# EAGLE design SyNetLEDv2 (EAGLE 6.1)
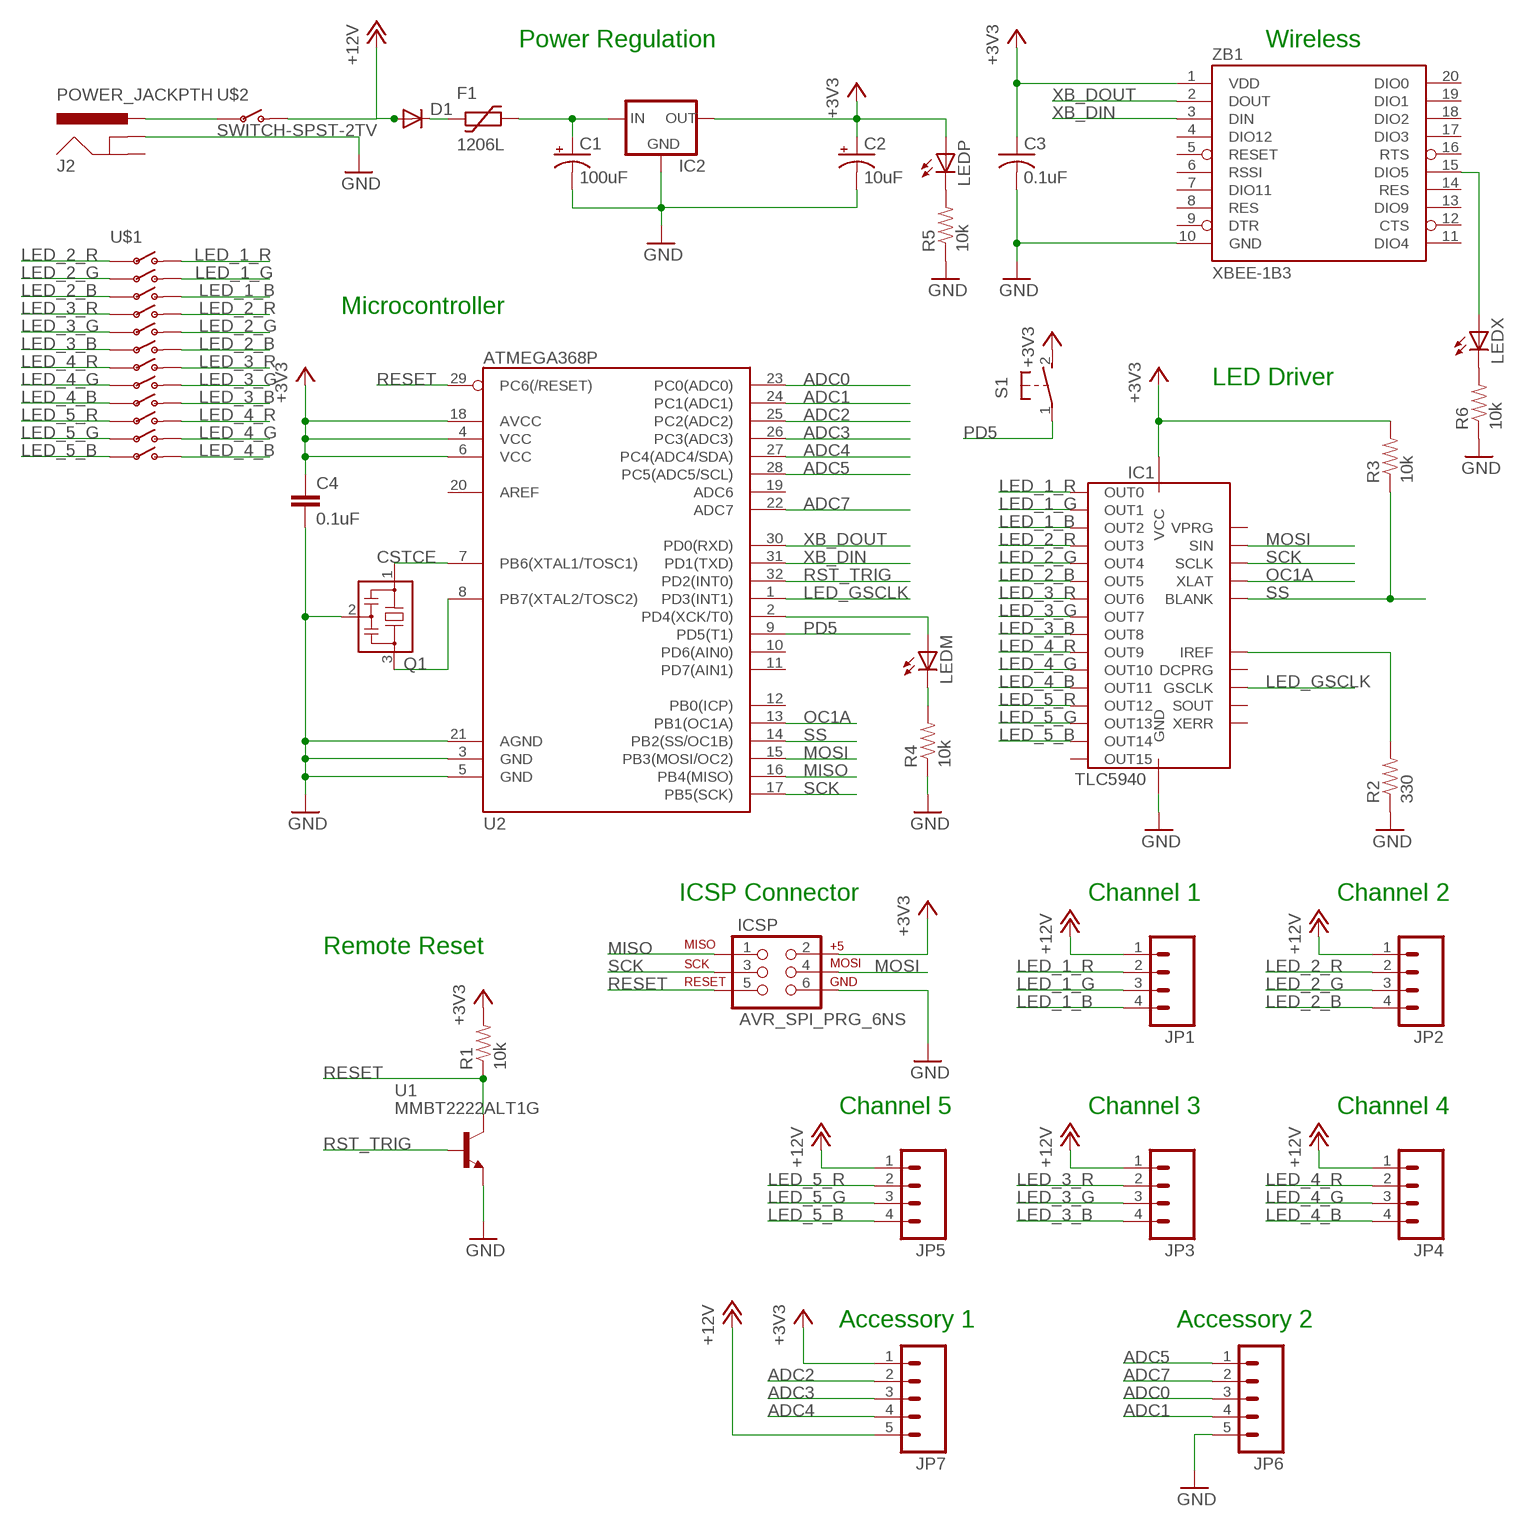
[diagram p0: schematic, sheet 1]

## Parts
C1  100uF  CPOL-USUD-8X10  [UD-8X10_NICHICON]
C2  10uF  CPOL-USUD-4X5,8  [UD-4X5,8_NICHICON]
C3  0.1uF  C-USC1608  [C1608]
C4  0.1uF  CAP0603-CAP  [0603-CAP]
D1  DIODESOD  [SOD-323]
F1  1206L  [1206L]
IC1  TLC5940  IC-PACKAGE_DIL28IC_PACKAGE_HTSSOP28PWP  [HTSSOP28PWP]
IC2  78LXXSMD  [SOT223]
ICSP  AVR_SPI_PRG_6NS  [2X3-NS]
J2  POWER_JACKPTH  [POWER_JACK_PTH]
JP1  M04POLAR  [MOLEX-1X4]
JP2  M04POLAR  [MOLEX-1X4]
JP3  M04POLAR  [MOLEX-1X4]
JP4  M04POLAR  [MOLEX-1X4]
JP5  M04POLAR  [MOLEX-1X4]
JP6  M05PTH  [1X05]
JP7  M05PTH  [1X05]
LEDM  LEDSMT-RT  [LED-SMT-RT]
LEDP  LEDSMT-RT  [LED-SMT-RT]
LEDX  LEDSMT-RT  [LED-SMT-RT]
Q1  CSTCE  [CSTCE8]
R1  10k  RESISTOR0603-RES  [0603-RES]
R2  330  RESISTOR0603-RES  [0603-RES]
R3  10k  RESISTOR0603-RES  [0603-RES]
R4  10k  RESISTOR0603-RES  [0603-RES]
R5  10k  RESISTOR0603-RES  [0603-RES]
R6  10k  RESISTOR0603-RES  [0603-RES]
S1  31-XX  [B3F-31XX]
U1  MMBT2222ALT1G  [SOT23]
U2  ATMEGA368P  [TQFP32-08]
U$1  DIP12DIP12TH  [DIP12TH]
U$2  SWITCH-SPST-2TV  [SWITCH-SPST-VERTICAL]
ZB1  XBEE-1B3  [XBEE-SMD]

## Nets
+3V3: C2.+ C3.1 C4.1 IC1.28(VCC) IC2.3(OUT) ICSP.2 JP7.1 LEDP.P$1A(A) R1.2 R3.2 S1.2(S) U2.4(VCC) U2.6(VCC) U2.18(AVCC) ZB1.1(VDD)
+12V: D1.2(A) JP1.1 JP2.1 JP3.1 JP4.1 JP5.1 JP7.5 U$2.1(O)
ADC0: JP6.3 U2.23(PC0(ADC0))
ADC1: JP6.4 U2.24(PC1(ADC1))
ADC2: JP7.2 U2.25(PC2(ADC2))
ADC3: JP7.3 U2.26(PC3(ADC3))
ADC4: JP7.4 U2.27(PC4(ADC4/SDA))
ADC5: JP6.1 U2.28(PC5(ADC5/SCL))
ADC7: JP6.2 U2.22(ADC7)
GND: C1.- C2.- C3.2 C4.2 IC1.1(GND) IC2.2(GND) IC2.4(GND) ICSP.6 J2.GNDBREAK JP6.5 Q1.2 R2.1 R4.1 R5.1 R6.1 U1.2(E) U2.3(GND) U2.5(GND) U2.21(AGND) ZB1.10(GND)
LED_1_B: IC1.9(OUT2) JP1.4 U$1.P$3(P3B)
LED_1_G: IC1.8(OUT1) JP1.3 U$1.P$2(P2B)
LED_1_R: IC1.7(OUT0) JP1.2 U$1.P$1(P1B)
LED_2_B: IC1.12(OUT5) JP2.4 U$1.O$3(P3A) U$1.P$6(P6B)
LED_2_G: IC1.11(OUT4) JP2.3 U$1.O$2(P2A) U$1.P$5(P5B)
LED_2_R: IC1.10(OUT3) JP2.2 U$1.O$1(P1A) U$1.P$4(P4B)
LED_3_B: IC1.15(OUT8) JP3.4 U$1.O$6(P6A) U$1.P$9(P9B)
LED_3_G: IC1.14(OUT7) JP3.3 U$1.O$5(P5A) U$1.P$8(P8B)
LED_3_R: IC1.13(OUT6) JP3.2 U$1.O$4(P4A) U$1.P$7(P7B)
LED_4_B: IC1.18(OUT11) JP4.4 U$1.O$9(P9A) U$1.P$12(P12B)
LED_4_G: IC1.17(OUT10) JP4.3 U$1.O$8(P8A) U$1.P$11(P11B)
LED_4_R: IC1.16(OUT9) JP4.2 U$1.O$7(P7A) U$1.P$10(P10B)
LED_5_B: IC1.21(OUT14) JP5.4 U$1.O$12(P12A)
LED_5_G: IC1.20(OUT13) JP5.3 U$1.O$11(P11A)
LED_5_R: IC1.19(OUT12) JP5.2 U$1.O$10(P10A)
LED_GSCLK: IC1.25(GSCLK) U2.1(PD3(INT1))
MISO: ICSP.1 U2.16(PB4(MISO))
MOSI: IC1.5(SIN) ICSP.4 U2.15(PB3(MOSI/OC2))
N$1: Q1.1 U2.7(PB6(XTAL1/TOSC1))
N$2: Q1.3 U2.8(PB7(XTAL2/TOSC2))
N$3: LEDM.P$1A(A) U2.2(PD4(XCK/T0))
N$4: D1.1(C) F1.P$1
N$5: C1.+ F1.P$2 IC2.1(IN)
N$6: IC1.27(IREF) R2.2
N$7: LEDM.P$2C(C) R4.2
N$8: LEDX.P$2C(C) R6.2
N$9: LEDP.P$2C(C) R5.2
N$10: LEDX.P$1A(A) ZB1.15(DIO5)
N$17: J2.PWR U$2.2(P)
OC1A: IC1.3(XLAT) U2.13(PB1(OC1A))
PD5: S1.1(P) U2.9(PD5(T1))
RESET: ICSP.5 R1.1 U1.3(C) U2.29(PC6(/RESET))
RST_TRIG: U1.1(B) U2.32(PD2(INT0))
SCK: IC1.4(SCLK) ICSP.3 U2.17(PB5(SCK))
SS: IC1.2(BLANK) R3.1 U2.14(PB2(SS/OC1B))
XB_DIN: U2.31(PD1(TXD)) ZB1.3(DIN)
XB_DOUT: U2.30(PD0(RXD)) ZB1.2(DOUT)
Unconnected: IC1.6(VPRG) IC1.22(OUT15) IC1.23(XERR) IC1.24(SOUT) IC1.26(DCPRG) J2.GND U2.10(PD6(AIN0)) U2.11(PD7(AIN1)) U2.12(PB0(ICP)) U2.19(ADC6) U2.20(AREF) ZB1.4(DIO12) ZB1.5(RESET) ZB1.6(RSSI) ZB1.7(DIO11) ZB1.8(RES) ZB1.9(DTR) ZB1.11(DIO4) ZB1.12(CTS) ZB1.13(DIO9) ZB1.14(RES) ZB1.16(RTS) ZB1.17(DIO3) ZB1.18(DIO2) ZB1.19(DIO1) ZB1.20(DIO0)

## Notes on the sheet
- Power Regulation | Wireless
- Microcontroller
- LED Driver
- ICSP Connector | Channel 1 | Channel 2
- Remote Reset
- Channel 5 | Channel 3 | Channel 4
- Accessory 1 | Accessory 2

## Library data of the parts
C1 C2 = rcl:CPOL-US: POLARIZED CAPACITOR, American symbol
C3 = rcl:C-US: CAPACITOR, American symbol
C4 = SparkFun-Passives:CAP: Capacitor Standard 0603 ceramic capacitor, and 0.1" leaded capacitor.
D1 = SparkFun-DiscreteSemi:DIODE: Diode These are standard reverse protection diodes and small signal diodes. SMA package can handle up to about 1A. SOD-323 can handle about 200mA. What the SOD-323 package when ordering, there are some mfgs out there that are 5-pin packages.
F1 = ptc-littlefuse:1206L
IC1 = TLC5940:IC-PACKAGE_DIL28: Dual In Line
IC2 = MikeCustom:78LXX: VOLTAGE REGULATOR
ICSP = SparkFun-Connectors:AVR_SPI_PRG_6: AVR ISP 6 Pin This is the reduced ISP connector for AVR programming. Common on Arduino. This footprint will take up less PCB space and can be used with a 10-pin to 6-pin adapter such as SKU: BOB-08508
J2 = SparkFun-Connectors:POWER_JACK: Power Jack This is the standard 5.5mm barrel jack for power. The PTH is the most common, proven, reliable, footprint. All others are experimental. The Slot footprint only works if the mill layer is transmitted to the PCB fab house so be warned. Spark Fun Electronics SKU : PRT-00119. Mating wall wart : TOL-00298 (and others)
JP1-JP5 = SparkFun-Connectors:M04: Header 4 Standard 4-pin 0.1" header. Use with straight break away headers (SKU : PRT-00116), right angle break away headers (PRT-00553), swiss pins (PRT-00743), machine pins (PRT-00117), and female headers (PRT-00115). Molex polarized connector foot print use with SKU : PRT-08231 with associated crimp pins and housings. 1MM SMD Version SKU: PRT-10208
JP6 JP7 = SparkFun-Connectors:M05: Header 5 Standard 5-pin 0.1" header. Use with straight break away headers (SKU : PRT-00116), right angle break away headers (PRT-00553), swiss pins (PRT-00743), machine pins (PRT-00117), and female headers (PRT-00115). Molex polarized connector foot print use with SKU : PRT-08230 with associated crimp pins and housings.
LEDM LEDP LEDX = SparkFun-LED:LED: LEDs Standard schematic elements and footprints for 5mm, 3mm, 1206, and 0603 sized LEDs. 5mm - Spark Fun Electronics SKU : COM-00529 (and others)
Q1 = murata-filter:CSTCE: Resonator Source: murata.co.jp
R1-R6 = SparkFun-Passives:RESISTOR: Resistor Basic schematic elements and footprints for 0603, 1206, and PTH resistors.
S1 = switch-omron:31-XX: OMRON SWITCH; MPN: B3F-3100; OC_FARNELL: 959704; OC_NEWARK: 36M3582
U1 = MikeCustom:MMBT2222ALT1G: NPN Transistor MMBT2222ALT1G from ON Semi
U2 = SparkFun-DigitalIC:ATMEGA368P: Atmega328P
U$1 = MikeCustom:DIP12
U$2 = MikeCustom:SWITCH-SPST-2
ZB1 = SparkFun-RF:XBEE-1: Xbee module footprints

## Board
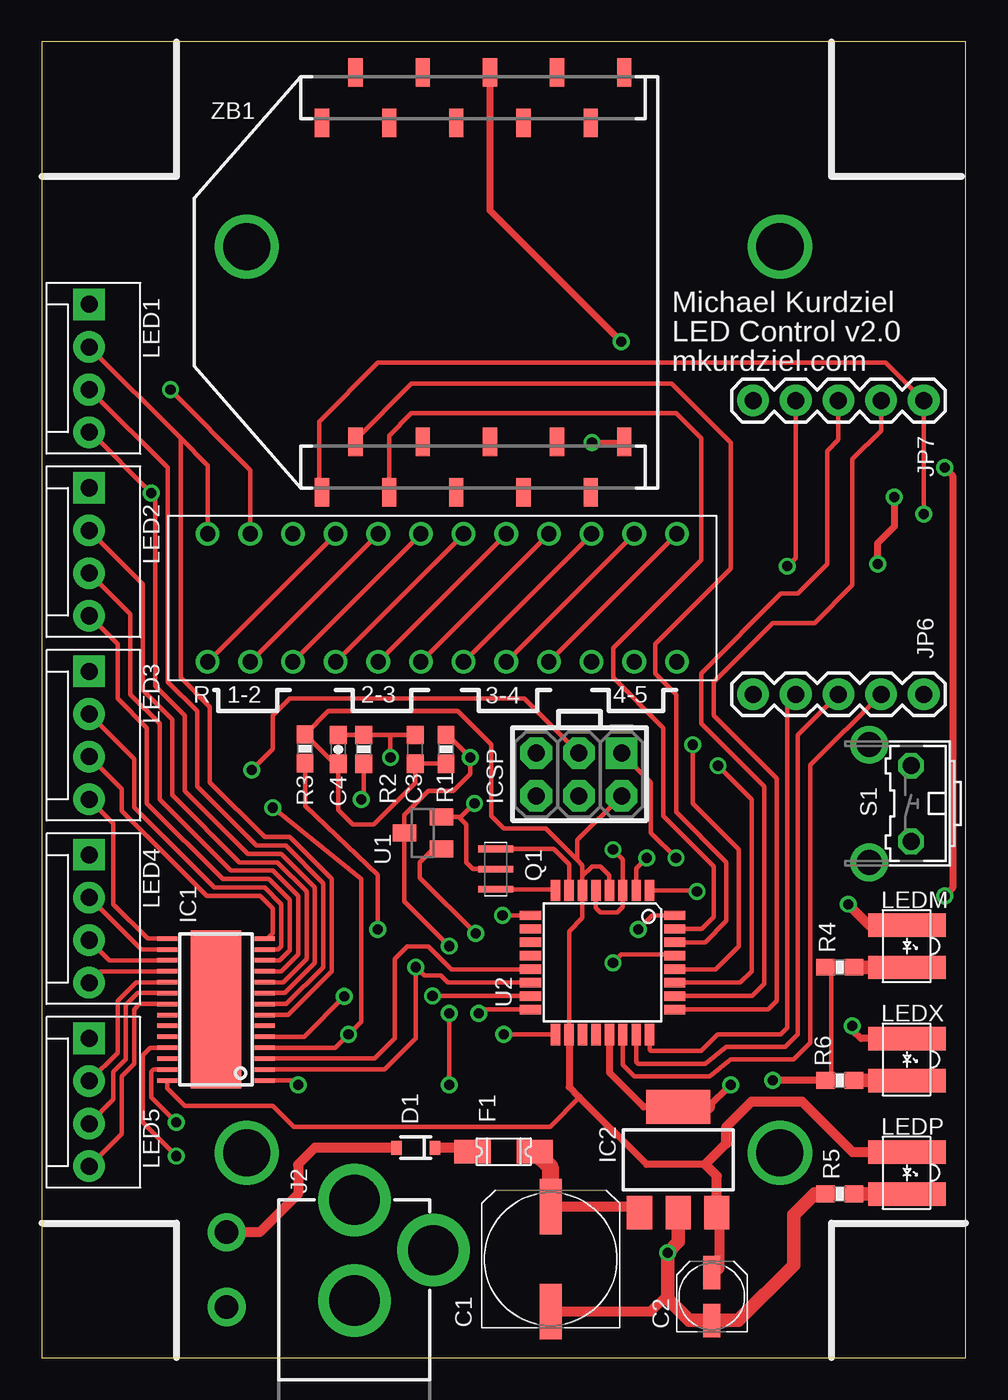
[diagram p1: board, top side]
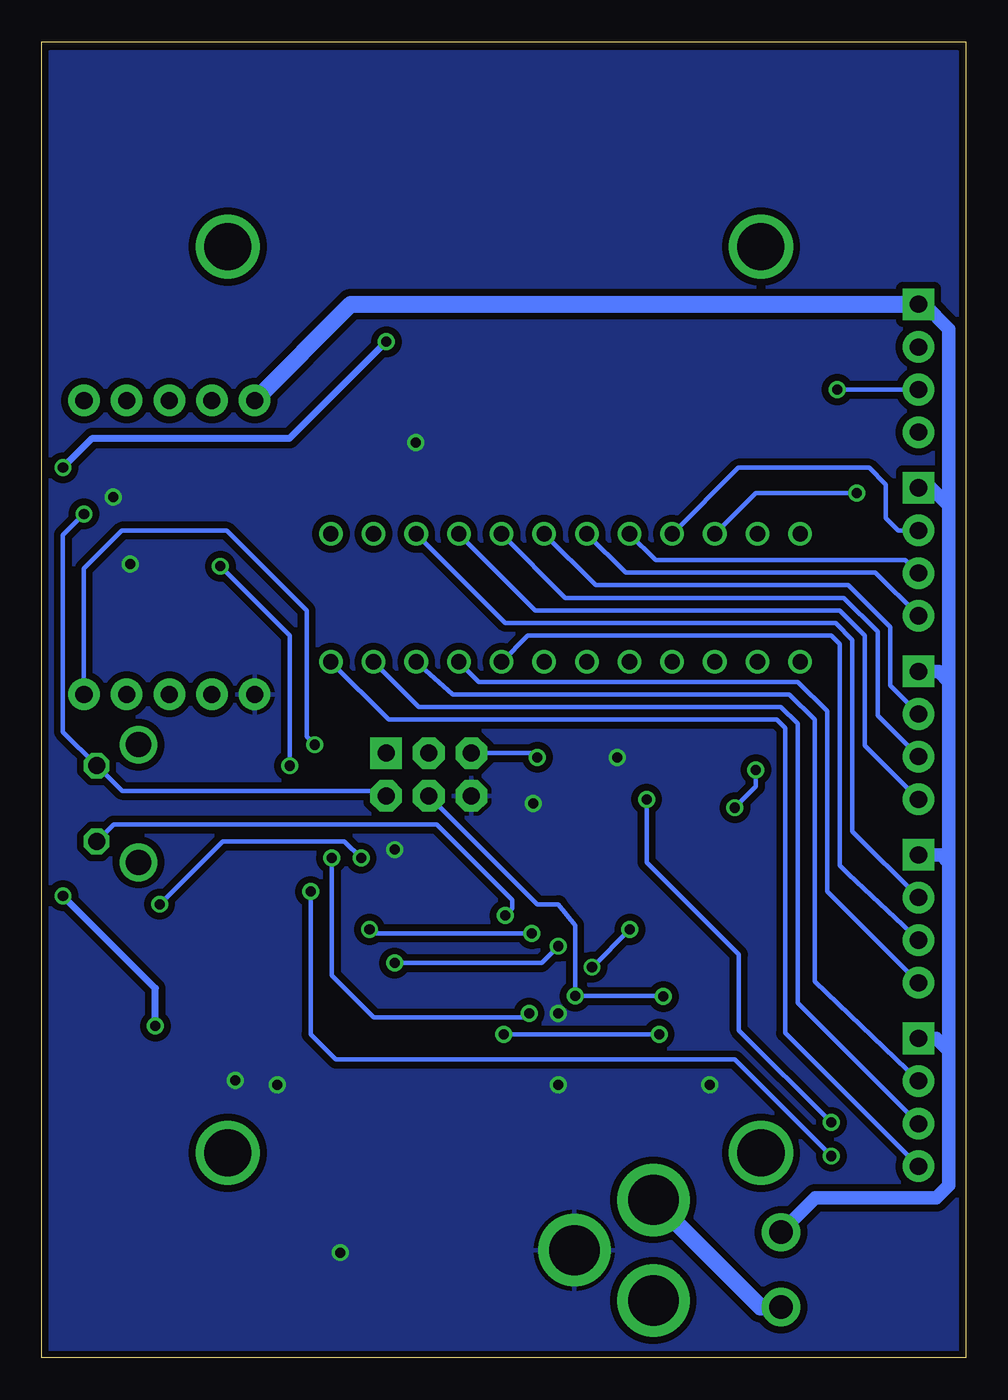
[diagram p2: board, bottom side, seen from below]

Size 55 x 78.36 mm. Coordinates in mm from the lower left corner, seen from the top.
Outline: 0,0 55,0 55,78.36 0,78.36 0,0
Copper layers (1*16): Top 0.035559375mm / dielectric 1.501140625mm / Bottom 0.035559375mm
Design rules: minimum track width 10mil, minimum drill 15mil, track to track 6mil, track to pad 6mil, pad to pad 6mil, via to via 6mil, smd to smd 6mil, copper to edge 15mil, drill to drill 8mil, minimum pad ring 10mil, minimum via ring 8mil, stop-mask expansion 4mil, vias tented up to drill 0mil, thermal gap 10mil

### Footprints (pad centres in the part's own frame; a part is rotated, then mirrored left to right if it is on the bottom)
UD-8X10_NICHICON = smd 3.3 x 1.3: + 3.125,0; - -3.125,0
UD-4X5,8_NICHICON = smd 2 x 1: + 1.425,0; - -1.425,0
C1608 = smd 1.1 x 1: 1 -0.85,0; 2 0.85,0
0603-CAP = smd 1.1 x 1: 1 -0.85,0; 2 0.85,0
SOD-323 = smd 0.63 x 0.83: 1 -1.15,0; 2 1.15,0
1206L = smd 2.16 x 1.4: P$1 -1.85,0; P$2 1.85,0
HTSSOP28PWP = smd 0.27 x 1.2: 1 -4.225,-2.9; 2 -3.575,-2.9; 3 -2.925,-2.9; 4 -2.275,-2.9; 5 -1.625,-2.9; 6 -0.975,-2.9; 7 -0.325,-2.9; 8 0.325,-2.9; 9 0.975,-2.9; 10 1.625,-2.9; 11 2.275,-2.9; 12 2.925,-2.9; 13 3.575,-2.9; 14 4.225,-2.9; 15 4.225,2.9; 16 3.575,2.9; 17 2.925,2.9; 18 2.275,2.9; 19 1.625,2.9; 20 0.975,2.9; 21 0.325,2.9; 22 -0.325,2.9; 23 -0.975,2.9; 24 -1.625,2.9; 25 -2.275,2.9; 26 -2.925,2.9; 27 -3.575,2.9; 28 -4.225,2.9 | smd 9.4 x 3: EXP 0,0
SOT223 = smd 1.5 x 2: 1 -2.3,-3.15; 2 0,-3.15; 3 2.3,-3.15 | smd 3.8 x 2: 4 0,3.15
2X3-NS = drill 1.016 pad 1.88 square: 1 -2.54,-1.27 | drill 1.016 pad 1.88 octagon: 2 -2.54,1.27; 3 0,-1.27; 4 0,1.27; 5 2.54,-1.27; 6 2.54,1.27
POWER_JACK_PTH = drill 2.997 pad 4.318: GND 0,7.7; GNDBREAK 4.7,10.7; PWR 0,13.7
MOLEX-1X4 = drill 1.016 pad 1.88 square: 1 0,0 | drill 1.016 pad 1.88: 2 2.54,0; 3 5.08,0; 4 7.62,0
1X05 = drill 1.016 pad 1.88: 1 0,0; 2 2.54,0; 3 5.08,0; 4 7.62,0; 5 10.16,0
LED-SMT-RT = smd 1.397 x 4.597: P$1A 0,0; P$2C 2.515,0
CSTCE8 = smd 0.4 x 2.1: 1 -1.8,0.3; 2 -0.6,0.3; 3 0.6,0.3
0603-RES = smd 1.1 x 1: 1 -0.85,0; 2 0.85,0
B3F-31XX = drill 1.016 octagon: 1 -2.261,-1.245; 2 2.261,-1.245 | drill 1.499 pad 2.159: 3 -3.505,1.245; 4 3.505,1.245
SOT23 = smd 1 x 1.4: 1 -0.95,-1.1; 2 0.95,-1.1; 3 0,1.1
TQFP32-08 = smd 1.27 x 0.559: 1 -4.293,2.8; 2 -4.293,2; 3 -4.293,1.2; 4 -4.293,0.4; 5 -4.293,-0.4; 6 -4.293,-1.2; 7 -4.293,-2; 8 -4.293,-2.8; 17 4.293,-2.8; 18 4.293,-2; 19 4.293,-1.2; 20 4.293,-0.4; 21 4.293,0.4; 22 4.293,1.2; 23 4.293,2; 24 4.293,2.8 | smd 0.559 x 1.27: 9 -2.8,-4.293; 10 -2,-4.293; 11 -1.2,-4.293; 12 -0.4,-4.293; 13 0.4,-4.293; 14 1.2,-4.293; 15 2,-4.293; 16 2.8,-4.293; 25 2.8,4.293; 26 2,4.293; 27 1.2,4.293; 28 0.4,4.293; 29 -0.4,4.293; 30 -1.2,4.293; 31 -2,4.293; 32 -2.8,4.293
DIP12TH = drill 0.9: O$1 2.36,-3.81; O$2 4.9,-3.81; O$3 7.44,-3.81; O$4 9.98,-3.81; O$5 12.52,-3.81; O$6 15.06,-3.81; O$7 17.6,-3.81; O$8 20.14,-3.81; O$9 22.68,-3.81; O$10 25.22,-3.81; O$11 27.76,-3.81; O$12 30.3,-3.81; P$1 2.36,3.81; P$2 4.9,3.81; P$3 7.44,3.81; P$4 9.98,3.81; P$5 12.52,3.81; P$6 15.06,3.81; P$7 17.6,3.81; P$8 20.14,3.81; P$9 22.68,3.81; P$10 25.22,3.81; P$11 27.76,3.81; P$12 30.3,3.81
SWITCH-SPST-VERTICAL = drill 1.4 pad 2.286: 1 0,4.46; 2 0,0
XBEE-SMD = smd 1.7 x 0.85: 1 -12.5,20; 2 -9.5,18; 3 -12.5,16; 4 -9.5,14; 5 -12.5,12; 6 -9.5,10; 7 -12.5,8; 8 -9.5,6; 9 -12.5,4; 10 -9.5,2; 11 12.5,2; 12 9.5,4; 13 12.5,6; 14 9.5,8; 15 12.5,10; 16 9.5,12; 17 12.5,14; 18 9.5,16; 19 12.5,18; 20 9.5,20

### Placement (x,y rotation side)
C1  30.29,5.87 90 top
C2  39.88,3.64 90 top
C3  22.22,36.23 90 top
C4  17.64,36.23 90 top
D1  22.25,12.5 180 top
F1  27.49,12.26 0 top
IC1  10.36,20.73 90 top
IC2  37.88,11.78 0 top
ICSP  31.97,34.73 180 top
J2  18.6,-4.31 0 top
JP1  2.81,62.73 270 top
JP2  2.81,51.8 270 top
JP3  2.81,40.87 270 top
JP4  2.81,29.94 270 top
JP5  2.81,19.01 270 top
JP6  52.5,39.5 180 top
JP7  52.5,57 180 top
LEDM  51.5,25.75 270 top
LEDP  51.5,12.25 270 top
LEDX  51.5,19 270 top
Q1  26.72,28.49 270 top
R1  24.05,36.23 270 top
R2  19.15,36.23 270 top
R3  15.66,36.26 90 top
R4  47.5,23.25 0 top
R5  47.5,9.75 0 top
R6  47.5,16.5 0 top
S1  50.5,33 90 top
U1  22.68,31.25 90 top
U2  33.38,23.53 270 top
U$1  7.5,45.25 0 top
U$2  11,3 0 top
ZB1  36.67,64.04 90 top

### Tracks (layer width: path | path; a pad name or v marks a point on that pad's centre or on a via)
+3V3  (via drill 0.6)
  Top 0.254: R1.2 C3.1 22.22,34.22 19.75,31.75 18.5,31.75 17.64,32.61 C4.1 17.39,35.38 R3.2 17.05,38.5 24.75,38.5 26.75,36.5 26.75,32.25 27.5,31.5 30,31.5 31.88,29.62 | U2.18 31.38,25.38 32.18,26.18 U2.6 32.18,28.68 | U2.4 33.78,28.72 33.25,29.25 32.75,29.25 32.18,28.68 | 40.31,8.44 40.31,7.75 | IC1.28 7.46,16.04 8.5,15 13.75,15 15,13.75 30.25,13.75 32,15.5 | ZB1.1 16.67,51.83 16.5,52 16.5,55.75 20,59.25 50.25,59.25 JP7.1 v52.5,50.25 | 32.18,28.68 32.18,29.32 31.88,29.62 | ICSP.2 31.88,30.82 31.88,29.62
  Top 0.406: 40.31,8.44 40.25,8.5 40.25,8.56 IC2.3 | 39.5,11.5 36,11.5 32,15.5 31.38,16.12 U2.18
  Top 0.61: IC2.3 40.18,10.82 39.5,11.5 40.75,12.75 40.75,13.75 42.25,15.25 45.25,15.25 48.25,12.25 LEDP.P$1A | 40.31,7.75 40.31,5.25 C2.+
  Bottom 0.254: ICSP.2 34.8,33.75 50.23,33.75 S1.2 53.75,37.27 53.75,49 v52.5,50.25
+12V
  Top 0.61: D1.2 16.25,12.5 15.25,11.5 15.25,9.75 12.96,7.46 U$2.1
  Bottom 0.813: JP1.1 2.48,62.73 1,61.25 1,50.75 | 1,50.75 1,40.25 | 1,40.25 1,29.5 | 1,29.5 1,18.25 | 1,18.25 1,10.25 1.75,9.5 8.96,9.5 U$2.1 | JP5.1 1.76,19.01 1,18.25 | JP4.1 1.44,29.94 1,29.5 | JP3.1 1.62,40.87 1,40.25 | JP2.1 2.05,51.8 1,50.75
  Bottom 1.016: JP1.1 36.61,62.73 JP7.5
ADC0
  Top 0.254: U2.23 35.38,17.62 35.5,17.5 39.5,17.5 40.75,18.5 44.25,18.5 45,19.25 45,37.08 JP6.3
ADC1
  Top 0.254: U2.24 36.18,18.32 36.25,18.25 39.25,18.25 40.25,19.25 44,19.25 44.38,19.63 44.38,39 JP6.4
ADC2
  Top 0.254: U2.25 43.23,20.73 43.75,21.25 43.75,34.5 40,38.25 40,40.25 43.5,43.75 46,43.75 48.25,46 48.25,53.5 49.96,55.21 JP7.2
ADC3
  Top 0.254: U2.26 42.28,21.53 43,22.25 43,34 39.25,37.75 39.25,40.75 44,45.5 45,45.5 46.75,47.25 46.75,54 47.42,54.67 JP7.3
ADC4  (via drill 0.6)
  Top 0.254: U2.27 41.58,22.33 42.25,23 42.25,33.25 v40.25,35.25 | JP7.4 44.88,47.63 v44.38,47.13
  Bottom 0.254: v44.38,47.13 40.25,43 v40.25,35.25
ADC5  (via drill 0.6)
  Top 0.254: U2.28 40.13,23.13 41.5,24.5 41.5,30.25 38.75,33 v38.75,36.5
  Bottom 0.254: JP6.1 52.5,47 50.25,49.25 44,49.25 39.25,44.5 39.25,37 v38.75,36.5
ADC7
  Top 0.254: U2.22 34.58,17.42 35.25,16.75 39.75,16.75 41,17.75 44.75,17.75 45.75,18.75 45.75,35.29 JP6.2
GND  (via drill 0.6)
  Top 0.254: U2.5 32.98,26.77 33.25,26.5 34.25,26.5 34.58,26.83 U2.3 34.58,29.67 v34,30.25 | U1.2 24.8,32.2 24.88,32.12 | 24.88,32.12 25.25,31.75 25.25,29.5 25.66,29.09 Q1.2 | R4.1 46.99,22.86 46.99,16.51 R6.1 | IC1.1 14.99,16.5 v15.25,16.25 | ZB1.10 32.79,54.54 v32.75,54.5 | C4.2 R2.1 | R2.1 20.75,37.08 | 20.75,37.08 C3.2 | R2.1 19.17,37.08 19.25,37 | v25.75,33 24.88,32.12 | v20.75,35.75 20.75,37.08 | v24.25,20.5 v24.25,16.25
  Top 0.305: IC2.2 38,8.5
  Top 0.406: U2.21 33.78,16.97 35.82,14.93 IC2.4 | R6.1 v43.5,16.5 | 39.68,14.93 v41,16.25 | v49.75,47.25 49.75,48.5 50.75,49.5 v50.75,51.25
  Top 0.61: C1.- 36.24,2.75 37.25,3.75
  Top 0.813: 38,8.5 38,8.25 37.88,8.13 37.88,6.88 v37.25,6.25 37.25,3.75 37.25,3.5 38.53,2.21 C2.- 41.47,2.21 44.75,5.5 44.75,8.5 46,9.75 R5.1 | IC2.4 39.68,14.93
  pour Bottom (isolate 0.406): 0.5,77.75 54.5,77.75 54.5,0.5 0.5,0.5
LED_1_B  (via drill 0.6)
  Top 0.254: IC1.9 14.46,21.7 16.25,23.5 16.25,28 14.25,30 12.25,30 8.5,33.75 8.5,38.25 6.75,40 6.75,51.25 v6.5,51.5 2.89,55.11 JP1.4
  Bottom 0.254: v6.5,51.5 12.5,51.5 U$1.P$3
LED_1_G  (via drill 0.6)
  Top 0.254: JP1.3 5.25,55.21 5.25,55.25 7.5,53 7.5,40.25 9.25,38.5 9.25,34 12.75,30.5 14.5,30.5 16.75,28.25 16.75,23.25 14.55,21.05 IC1.8 | U$1.P$2 12.4,52.85 v7.65,57.65
  Bottom 0.254: v7.65,57.65 JP1.3
LED_1_R
  Top 0.254: 8.25,54.75 8.25,40.5 10,38.75 10,34.25 13.25,31 14.75,31 17.25,28.5 17.25,23 14.65,20.41 IC1.7 | 8.25,54.75 JP1.2 | 8.25,54.75 9.86,53.14 U$1.P$1
LED_2_B
  Top 0.254: JP2.4 4.5,42.49 4.5,39.25 6.25,37.5 6.25,33 10.75,28.5 13.5,28.5 14.75,27.25 14.75,24.25 14.15,23.66 IC1.12 | U$1.P$6 U$1.O$3
  Bottom 0.254: U$1.P$6 20.25,46.75 5.38,46.75 JP2.4
LED_2_G
  Top 0.254: JP2.3 5.25,44.28 5.25,39.5 7,37.75 7,33.25 11.25,29 13.75,29 15.25,27.5 15.25,24 14.26,23 IC1.11 | U$1.P$5 U$1.O$2
  Bottom 0.254: JP2.3 3.59,47.5 18.46,47.5 U$1.P$5
LED_2_R
  Top 0.254: JP2.2 6,46.07 6,39.75 7.75,38 7.75,33.5 11.75,29.5 14,29.5 15.75,27.75 15.75,23.75 14.36,22.36 IC1.10 | U$1.P$4 U$1.O$1
  Bottom 0.254: JP2.2 4.01,49.26 4.75,50 4.75,52 5.75,53 13.54,53 U$1.P$4
LED_3_B
  Top 0.254: JP3.4 4.25,31.81 4.25,27 6.29,24.95 IC1.15 | U$1.P$9 U$1.O$6
  Bottom 0.254: U$1.P$9 25.62,44.5 7.5,44.5 6,43 6,36.44 JP3.4
LED_3_G
  Top 0.254: JP3.3 4.75,33.85 4.75,32.55 9.8,27.5 13,27.5 13.75,26.75 13.75,25.25 13.46,24.95 IC1.14 | U$1.P$8 U$1.O$5
  Bottom 0.254: U$1.P$8 23.83,45.25 7.25,45.25 5.25,43.25 5.25,38.23 JP3.3
LED_3_R
  Top 0.254: JP3.2 5.5,35.64 5.5,32.75 10.25,28 13.25,28 14.25,27 14.25,24.5 14.05,24.3 IC1.13 | U$1.P$7 U$1.O$4
  Bottom 0.254: U$1.P$7 22.04,46 7,46 4.5,43.5 4.5,40.02 JP3.2
LED_4_B
  Top 0.254: JP4.4 3.49,23 IC1.18 | U$1.P$12 U$1.O$9
  Bottom 0.254: U$1.O$9 28.99,40.25 10,40.25 8.25,38.5 8.25,27.75 7.99,27.5 JP4.4
LED_4_G
  Top 0.254: JP4.3 4.01,23.66 IC1.17 | U$1.P$11 U$1.O$8
  Bottom 0.254: JP4.3 7,28.8 7.5,29.3 7.5,42.5 8,43 26.08,43 U$1.O$8
LED_4_R
  Top 0.254: JP4.2 5.91,24.3 IC1.16 | U$1.P$10 U$1.O$7
  Bottom 0.254: U$1.P$10 27.41,43.75 7.75,43.75 6.75,42.75 6.75,31.34 JP4.2
LED_5_B
  Top 0.254: IC1.21 5.8,21.05 5.5,20.75 5.5,17.5 4.75,16.75 4.75,13.33 JP5.4
  Bottom 0.254: U$1.O$12 34.36,38 11.25,38 10.75,37.5 10.75,19.33 JP5.4
LED_5_G
  Top 0.254: IC1.20 5.71,21.7 5,21 5,17.75 4.25,17 4.25,15.37 JP5.3
  Bottom 0.254: U$1.O$11 32.57,38.75 11,38.75 10,37.75 10,21.12 JP5.3
LED_5_R
  Top 0.254: IC1.19 5.61,22.36 4.5,21.25 4.5,18.16 JP5.2
  Bottom 0.254: U$1.O$10 30.53,39.5 10.5,39.5 9,38 9,22.41 JP5.2
LED_GSCLK  (via drill 0.6)
  Top 0.254: U2.1 38.93,27.82 v39,27.75 | IC1.25 6.46,18.45 6,18 6,14 v8,12
  Bottom 0.254: v39,27.75 39,19.25 37.5,17.75 13.75,17.75 v8,12
MISO  (via drill 0.6)
  Top 0.254: v37.75,29.75 36.25,31.25 36.25,34.26 ICSP.1 | v26,20.5 26.23,20.73 U2.16
  Bottom 0.254: v37.75,29.75 37.75,22.75 35.25,20.25 26.25,20.25 v26,20.5
MOSI  (via drill 0.6)
  Top 0.254: U2.15 v23.25,21.53 | IC1.5 15.61,19.11 v18,21.5
  Bottom 0.254: ICSP.4 25.51,27 24.25,27 23.25,25.75 v23.25,21.53 18.03,21.53 v18,21.5
N$1
  Top 0.254: U2.7 31.38,29.37 30.46,30.29 Q1.1
N$2
  Top 0.254: Q1.3 30.4,27.89 U2.8
N$3  (via drill 0.6)
  Top 0.254: U2.2 35.38,29.13 v36,29.75
  Top 0.61: LEDM.P$1A 49.25,25.75 v48,27
  Bottom 0.254: v36,29.75 37,30.75 44.25,30.75 v48,27
N$4
  Top 0.61: D1.1 25.24,12.51 25.5,12.25 F1.P$1
N$5
  Top 0.61: C1.+ 35.22,8.99 IC2.1
  Top 1.016: F1.P$2 30.25,11.35 30.25,9.04 C1.+
N$6  (via drill 0.6)
  Top 0.254: R2.2 19.15,33.65 v19,33.25 | IC1.27 6.66,17.16 6.5,17 6.5,15.5 v8,14
  Bottom 0.254: v8,14 13.5,19.5 13.5,24 19,29.5 v19,33.25
N$7
  Top 0.406: 52.23,23.25 LEDM.P$2C
  Top 0.813: R4.2 52.23,23.25
N$8
  Top 0.406: 52.23,16.5 LEDX.P$2C
  Top 0.813: R6.2 52.23,16.5
N$9
  Top 0.406: 52.23,9.75 LEDP.P$2C
  Top 0.813: R5.2 52.23,9.75
N$10  (via drill 0.6)
  Top 0.406: v53.75,27.5 54.25,28 54.25,52.5 v53.75,53 | v48.25,19.75 48.25,19.5 48.75,19 LEDX.P$1A | ZB1.15 26.67,68.33 v34.5,60.5
  Bottom 0.406: v53.75,27.5 48.25,22 v48.25,19.75 | v53.75,53 52,54.75 40.25,54.75 v34.5,60.5
N$11  (via drill 2.8 pad 2.18)
  other vias: 43.94,12.19
N$12  (via drill 2.8 pad 2.18)
  other vias: 12.19,12.19
N$13  (via drill 2.8 pad 2.18)
  other vias: 43.94,66.17
N$14  (via drill 2.8 pad 2.18)
  other vias: 12.19,66.17
N$17
  Bottom 1.016: U$2.2 12.21,3 J2.PWR
OC1A
  Top 0.254: IC1.3 19.8,17.8 21,19 21,23.75 21.75,24.5 23,24.5 24.37,23.13 U2.13
PD5  (via drill 0.6)
  Top 0.254: U2.9 v27.42,26.33
  Bottom 0.254: v27.42,26.33 27,26.75 27,27.25 31.5,31.75 50.73,31.75 S1.1
RESET  (via drill 0.6)
  Top 0.254: 37.6,24 34.5,24 v34,23.5 | v24.25,24.5 21.58,27.17 U1.3 21.58,32.33 23,33.75 24.5,33.75 25.5,34.75 v25.5,35.75 24.17,37.08 R1.1
  Top 0.305: U2.29 37.6,24
  Bottom 0.254: v34,23.5 25.25,23.5 v24.25,24.5 | ICSP.5 25.75,36 v25.5,35.75
RST_TRIG  (via drill 0.6)
  Top 0.254: U2.32 36.33,26.33 v35.5,25.5 | 23.3,30.3 22.5,29.5 22.5,28.58 v25.83,25.25
  Top 0.406: U1.1 23.3,30.3
  Bottom 0.254: v25.83,25.25 35.25,25.25 v35.5,25.5
SCK  (via drill 0.6)
  Top 0.254: IC1.4 17.45,18.45 v18.25,19.25 19,20 19,28.5 v13.75,32.75 | ICSP.3 28.72,39.25 14.75,39.25 13.75,38.25 13.75,36.25 v12.5,35 | v27.5,19.24 U2.17
  Bottom 0.254: v12.5,35 12.5,34 v13.75,32.75 | v27.5,19.24 18.26,19.24 v18.25,19.25
SS  (via drill 0.6)
  Top 0.254: U2.14 24.17,22.33 23.75,22.75 22.75,22.75 v22.25,23.25 22.25,19 20.41,17.16 IC1.2 | v20,25.5 20,28.75 15.66,32.84 R3.1
  Bottom 0.254: v20,25.5 v22.25,23.25
XB_DIN
  Top 0.254: U2.31 39.28,25.53 40,26.25 40,29.25 37,32.25 37,37.5 34,40.5 34,42.25 39.25,47.5 39.25,54.75 37.75,56.25 22,56.25 20.67,54.92 ZB1.3
XB_DOUT
  Top 0.254: U2.30 39.48,24.73 40.75,26 40.75,29.5 37.75,32.5 37.75,39.5 36.5,40.75 36.5,42.5 41,47 41,54.5 37.5,58 22,58 18.67,54.67 ZB1.2

### Text on the board
tNames: Michael Kurdziel | LED1 | LED Control v2.0 | mkurdziel.com | LED2 | R | 1-2 | 2-3 | 3-4 | 4-5 | LED3 | LED4 | F1 | LED5